# Altium schematic sheet 11-DSP PROCESSOR 1-OF-3.SchDoc
size 513 x 386 mm
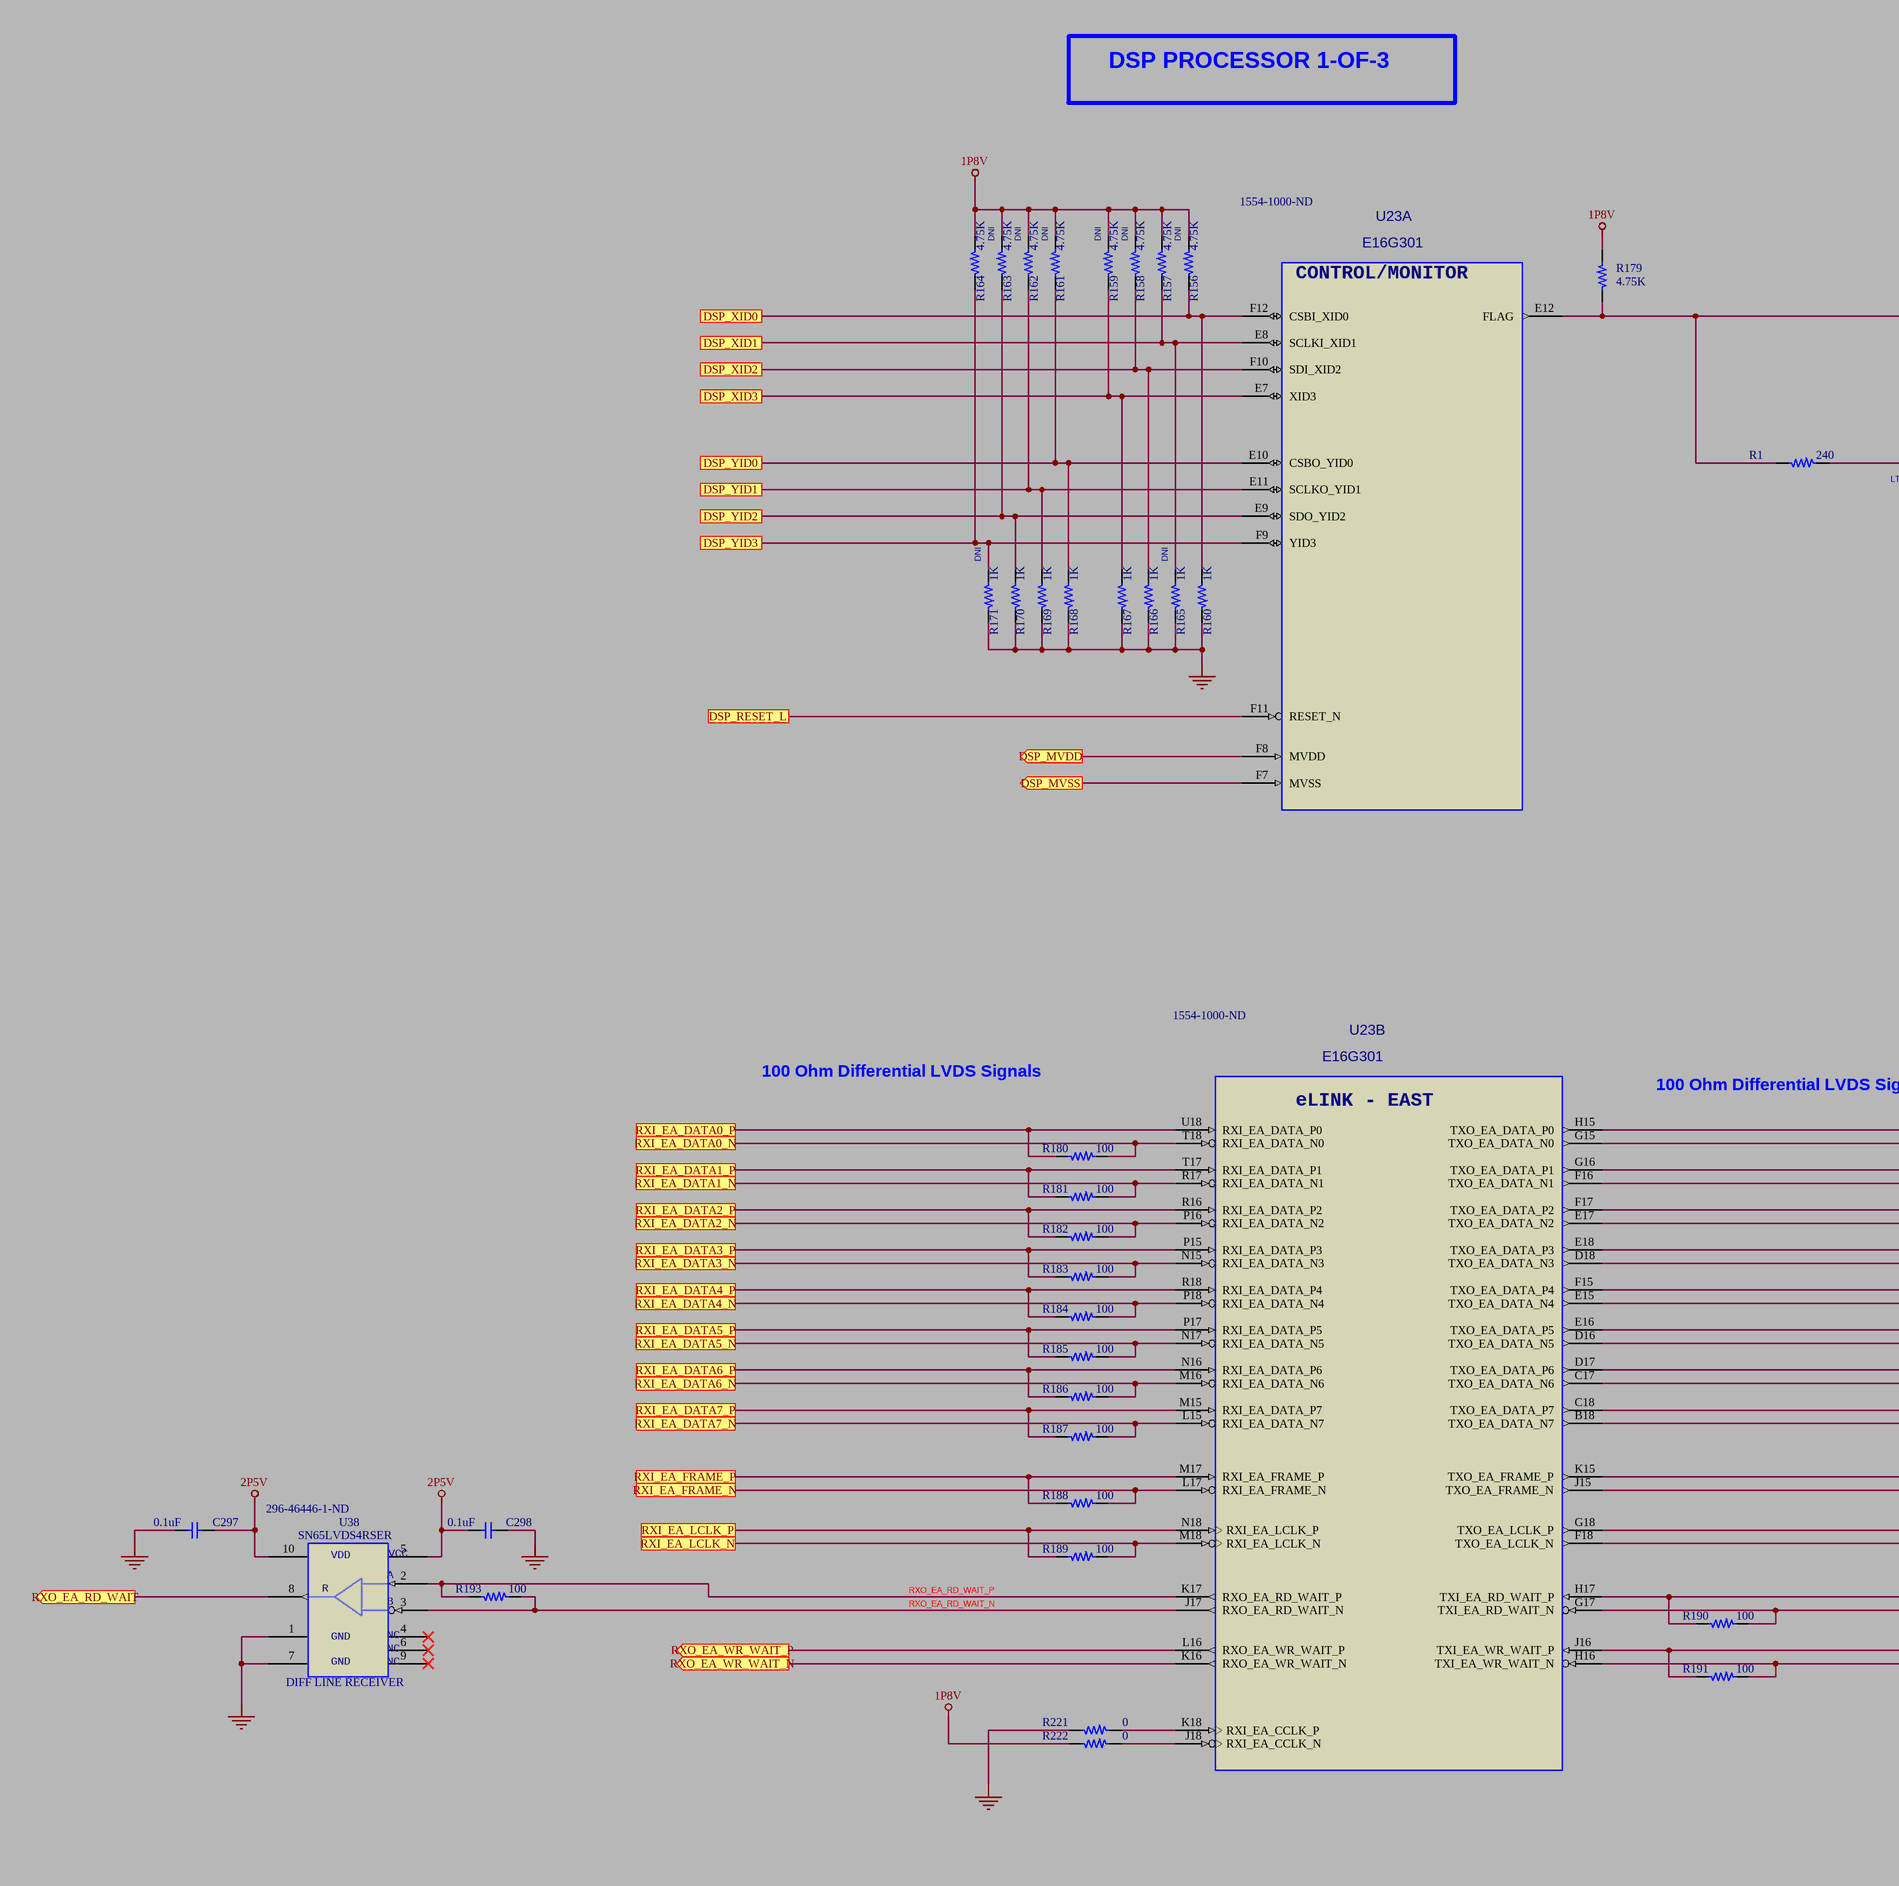
[diagram p0: 11-DSP PROCESSOR 1-OF-3.SchDoc, left]
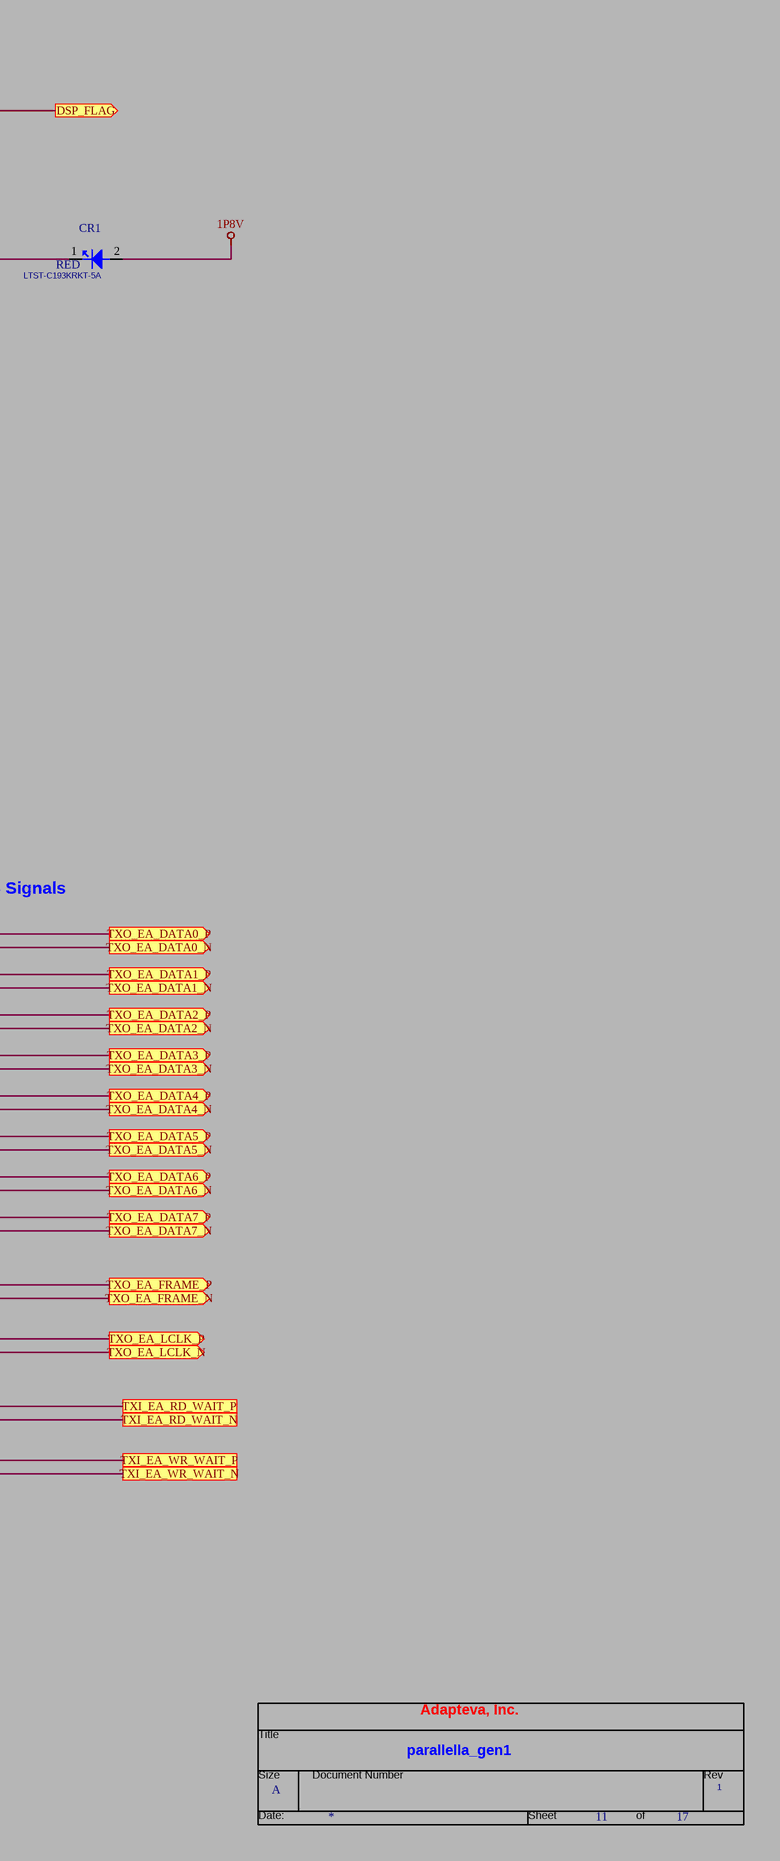
[diagram p1: 11-DSP PROCESSOR 1-OF-3.SchDoc, right]

## Parts
*  RevCode: 1  Title: parallella_gen1  Page Size: A  Page Number: 11  Page Count: 17  OrgAddr1: Adapteva, Inc.  (hidden comment: TitleBlock0)  (graphical)
C297  0.1uF  [C0402]
C298  0.1uF  [C0402]
CR1  RED  Vendor PN: LTST-C193KRKT-5A  [LED_0603]
R1  240  [R0402]
R156  4.75K  INSTALL: DNI  [R0402]
R157  4.75K  [R0402]
R158  4.75K  INSTALL: DNI  [R0402]
R159  4.75K  INSTALL: DNI  [R0402]
R160  1K  [R0402]
R161  4.75K  INSTALL: DNI  [R0402]
R162  4.75K  INSTALL: DNI  [R0402]
R163  4.75K  INSTALL: DNI  [R0402]
R164  4.75K  [R0402]
R165  1K  INSTALL: DNI  [R0402]
R166  1K  [R0402]
R167  1K  [R0402]
R168  1K  [R0402]
R169  1K  [R0402]
R170  1K  [R0402]
R171  1K  INSTALL: DNI  [R0402]
R179  4.75K  [R0402]
R180  100  [R0402]
R181  100  [R0402]
R182  100  [R0402]
R183  100  [R0402]
R184  100  [R0402]
R185  100  [R0402]
R186  100  [R0402]
R187  100  [R0402]
R188  100  [R0402]
R189  100  [R0402]
R190  100  [R0402]
R191  100  [R0402]
R193  100  [R0402]
R221  0  [R0402]
R222  0  [R0402]
U23  Vendor PN: E16G301  Supplier Part Number 1: 1554-1000-ND  [BGA324_15SQX1P5_P8MMP]  (hidden comment: 16-CORE MICROPROCESSOR)  (parts A,B of 6)
U38  DIFF LINE RECEIVER  Vendor PN: SN65LVDS4RSER  Supplier Part Number 1: 296-46446-1-ND  [QFN-10_1P55X2P05XP6XP5MMP]

## Ports
DSP_FLAG (out), DSP_MVDD (out), DSP_MVSS (out), DSP_RESET_L, DSP_XID0, DSP_XID1, DSP_XID2, DSP_XID3, DSP_YID0, DSP_YID1, DSP_YID2, DSP_YID3, RXI_EA_DATA0_N, RXI_EA_DATA0_P, RXI_EA_DATA1_N, RXI_EA_DATA1_P, RXI_EA_DATA2_N, RXI_EA_DATA2_P, RXI_EA_DATA3_N, RXI_EA_DATA3_P, RXI_EA_DATA4_N, RXI_EA_DATA4_P, RXI_EA_DATA5_N, RXI_EA_DATA5_P, RXI_EA_DATA6_N, RXI_EA_DATA6_P, RXI_EA_DATA7_N, RXI_EA_DATA7_P, RXI_EA_FRAME_N, RXI_EA_FRAME_P, RXI_EA_LCLK_N, RXI_EA_LCLK_P, RXO_EA_RD_WAIT (out), RXO_EA_WR_WAIT_N (out), RXO_EA_WR_WAIT_P (out), TXI_EA_RD_WAIT_N, TXI_EA_RD_WAIT_P, TXI_EA_WR_WAIT_N, TXI_EA_WR_WAIT_P, TXO_EA_DATA0_N (out), TXO_EA_DATA0_P (out), TXO_EA_DATA1_N (out), TXO_EA_DATA1_P (out), TXO_EA_DATA2_N (out), TXO_EA_DATA2_P (out), TXO_EA_DATA3_N (out), TXO_EA_DATA3_P (out), TXO_EA_DATA4_N (out), TXO_EA_DATA4_P (out), TXO_EA_DATA5_N (out), TXO_EA_DATA5_P (out), TXO_EA_DATA6_N (out), TXO_EA_DATA6_P (out), TXO_EA_DATA7_N (out), TXO_EA_DATA7_P (out), TXO_EA_FRAME_N (out), TXO_EA_FRAME_P (out), TXO_EA_LCLK_N (out), TXO_EA_LCLK_P (out)

## Nets
1P8V: CR1.2(A) R156.2 R157.2 R158.2 R159.2 R161.2 R162.2 R163.2 R164.2 R179.2 R222.1
2P5V: C297.2 C298.1 U38.5(VCC) U38.10(VDD)
GND: C297.1 C298.2 R160.2 R165.2 R166.2 R167.2 R168.2 R169.2 R170.2 R171.2 R221.1 U38.1(GND1) U38.7(GND2)
DSP_FLAG: R1.1 R179.1 U23.E12(FLAG) ; port DSP_FLAG
DSP_MVDD: U23.F8(MVDD) ; port DSP_MVDD
DSP_MVSS: U23.F7(MVSS) ; port DSP_MVSS
DSP_RESET_L: U23.F11(RESET_N) ; port DSP_RESET_L
DSP_XID0: R156.1 R160.1 U23.F12(CSBI_XID0) ; port DSP_XID0
DSP_XID1: R157.1 R165.1 U23.E8(SCLKI_XID1) ; port DSP_XID1
DSP_XID2: R158.1 R166.1 U23.F10(SDI_XID2) ; port DSP_XID2
DSP_XID3: R159.1 R167.1 U23.E7(XID3) ; port DSP_XID3
DSP_YID0: R161.1 R168.1 U23.E10(CSBO_YID0) ; port DSP_YID0
DSP_YID1: R162.1 R169.1 U23.E11(SCLKO_YID1) ; port DSP_YID1
DSP_YID2: R163.1 R170.1 U23.E9(SDO_YID2) ; port DSP_YID2
DSP_YID3: R164.1 R171.1 U23.F9(YID3) ; port DSP_YID3
RXI_EA_DATA0_N: R180.2 U23.T18(RXI_EA_DATA_N0) ; port RXI_EA_DATA0_N
RXI_EA_DATA0_P: R180.1 U23.U18(RXI_EA_DATA_P0) ; port RXI_EA_DATA0_P
RXI_EA_DATA1_N: R181.2 U23.R17(RXI_EA_DATA_N1) ; port RXI_EA_DATA1_N
RXI_EA_DATA1_P: R181.1 U23.T17(RXI_EA_DATA_P1) ; port RXI_EA_DATA1_P
RXI_EA_DATA2_N: R182.2 U23.P16(RXI_EA_DATA_N2) ; port RXI_EA_DATA2_N
RXI_EA_DATA2_P: R182.1 U23.R16(RXI_EA_DATA_P2) ; port RXI_EA_DATA2_P
RXI_EA_DATA3_N: R183.2 U23.N15(RXI_EA_DATA_N3) ; port RXI_EA_DATA3_N
RXI_EA_DATA3_P: R183.1 U23.P15(RXI_EA_DATA_P3) ; port RXI_EA_DATA3_P
RXI_EA_DATA4_N: R184.2 U23.P18(RXI_EA_DATA_N4) ; port RXI_EA_DATA4_N
RXI_EA_DATA4_P: R184.1 U23.R18(RXI_EA_DATA_P4) ; port RXI_EA_DATA4_P
RXI_EA_DATA5_N: R185.2 U23.N17(RXI_EA_DATA_N5) ; port RXI_EA_DATA5_N
RXI_EA_DATA5_P: R185.1 U23.P17(RXI_EA_DATA_P5) ; port RXI_EA_DATA5_P
RXI_EA_DATA6_N: R186.2 U23.M16(RXI_EA_DATA_N6) ; port RXI_EA_DATA6_N
RXI_EA_DATA6_P: R186.1 U23.N16(RXI_EA_DATA_P6) ; port RXI_EA_DATA6_P
RXI_EA_DATA7_N: R187.2 U23.L15(RXI_EA_DATA_N7) ; port RXI_EA_DATA7_N
RXI_EA_DATA7_P: R187.1 U23.M15(RXI_EA_DATA_P7) ; port RXI_EA_DATA7_P
RXI_EA_FRAME_N: R188.2 U23.L17(RXI_EA_FRAME_N) ; port RXI_EA_FRAME_N
RXI_EA_FRAME_P: R188.1 U23.M17(RXI_EA_FRAME_P) ; port RXI_EA_FRAME_P
RXI_EA_LCLK_N: R189.2 U23.M18(RXI_EA_LCLK_N) ; port RXI_EA_LCLK_N
RXI_EA_LCLK_P: R189.1 U23.N18(RXI_EA_LCLK_P) ; port RXI_EA_LCLK_P
RXO_EA_RD_WAIT: U38.8(R) ; port RXO_EA_RD_WAIT
RXO_EA_RD_WAIT_N: R193.2 U23.J17(RXO_EA_RD_WAIT_N) U38.3(B)
RXO_EA_RD_WAIT_P: R193.1 U23.K17(RXO_EA_RD_WAIT_P) U38.2(A)
RXO_EA_WR_WAIT_N: U23.K16(RXO_EA_WR_WAIT_N) ; port RXO_EA_WR_WAIT_N
RXO_EA_WR_WAIT_P: U23.L16(RXO_EA_WR_WAIT_P) ; port RXO_EA_WR_WAIT_P
TXI_EA_RD_WAIT_N: R190.2 U23.G17(TXI_EA_RD_WAIT_N) ; port TXI_EA_RD_WAIT_N
TXI_EA_RD_WAIT_P: R190.1 U23.H17(TXI_EA_RD_WAIT_P) ; port TXI_EA_RD_WAIT_P
TXI_EA_WR_WAIT_N: R191.2 U23.H16(TXI_EA_WR_WAIT_N) ; port TXI_EA_WR_WAIT_N
TXI_EA_WR_WAIT_P: R191.1 U23.J16(TXI_EA_WR_WAIT_P) ; port TXI_EA_WR_WAIT_P
TXO_EA_DATA0_N: U23.G15(TXO_EA_DATA_N0) ; port TXO_EA_DATA0_N
TXO_EA_DATA0_P: U23.H15(TXO_EA_DATA_P0) ; port TXO_EA_DATA0_P
TXO_EA_DATA1_N: U23.F16(TXO_EA_DATA_N1) ; port TXO_EA_DATA1_N
TXO_EA_DATA1_P: U23.G16(TXO_EA_DATA_P1) ; port TXO_EA_DATA1_P
TXO_EA_DATA2_N: U23.E17(TXO_EA_DATA_N2) ; port TXO_EA_DATA2_N
TXO_EA_DATA2_P: U23.F17(TXO_EA_DATA_P2) ; port TXO_EA_DATA2_P
TXO_EA_DATA3_N: U23.D18(TXO_EA_DATA_N3) ; port TXO_EA_DATA3_N
TXO_EA_DATA3_P: U23.E18(TXO_EA_DATA_P3) ; port TXO_EA_DATA3_P
TXO_EA_DATA4_N: U23.E15(TXO_EA_DATA_N4) ; port TXO_EA_DATA4_N
TXO_EA_DATA4_P: U23.F15(TXO_EA_DATA_P4) ; port TXO_EA_DATA4_P
TXO_EA_DATA5_N: U23.D16(TXO_EA_DATA_N5) ; port TXO_EA_DATA5_N
TXO_EA_DATA5_P: U23.E16(TXO_EA_DATA_P5) ; port TXO_EA_DATA5_P
TXO_EA_DATA6_N: U23.C17(TXO_EA_DATA_N6) ; port TXO_EA_DATA6_N
TXO_EA_DATA6_P: U23.D17(TXO_EA_DATA_P6) ; port TXO_EA_DATA6_P
TXO_EA_DATA7_N: U23.B18(TXO_EA_DATA_N7) ; port TXO_EA_DATA7_N
TXO_EA_DATA7_P: U23.C18(TXO_EA_DATA_P7) ; port TXO_EA_DATA7_P
TXO_EA_FRAME_N: U23.J15(TXO_EA_FRAME_N) ; port TXO_EA_FRAME_N
TXO_EA_FRAME_P: U23.K15(TXO_EA_FRAME_P) ; port TXO_EA_FRAME_P
TXO_EA_LCLK_N: U23.F18(TXO_EA_LCLK_N) ; port TXO_EA_LCLK_N
TXO_EA_LCLK_P: U23.G18(TXO_EA_LCLK_P) ; port TXO_EA_LCLK_P
NetCR1_1: CR1.1(C) R1.2
NetR221_2: R221.2 U23.K18(RXI_EA_CCLK_P)
NetR222_2: R222.2 U23.J18(RXI_EA_CCLK_N)

Not connected (* = marked no-connect by the designer): U38 4(NC1)* 6(NC2)* 9(NC3)*

## Notes on the sheet
- DSP PROCESSOR 1-OF-3
- 100 Ohm Differential LVDS Signals
- (in symbol EPIPHANY_E16G301, part A) CONTROL/MONITOR
- (in symbol EPIPHANY_E16G301, part B) eLINK - EAST
- (in symbol SN65LVDS4) GND; NC
- (in symbol TitleBlock0) Title; Size; Document Number; Rev; Date:; Sheet; of

## Library data of the parts
C297 C298 = CAP0402_0P1UF_X5R_35V: CAP, 0402, 0.1UF, X5R, 35V; ALT_SYMBOLS: C0402_BGA; Vendor PN: GMK105BJ104KV-F; Vendor: TAIYO YUDEN; DEVICE: CAP0402_0P1UF_X5R_35V; MFG PART NO: GMK105BJ104KV-F; MFG: TAIYO YUDEN; PCB Footprint: C0402
CR1 = LED_0603_5MA_RED: LED, 0603, 5MA, SMT, RED; Voltage: 2V; MFG: LITE-ON INC; MFG PART NO: LTST-C193KRKT-5A; Vendor: LITE-ON INC; PCB Footprint: LED_0603
R1 = RES0402_240: RES, 0402, 240, 1%; MFG PART NO: CRCW0402240RFKED; ALT_SYMBOLS: R0402_BGA; MFG: VISHAY; Vendor: VISHAY/DALE; DEVICE: RES0402_240; Vendor PN: CRCW0402240RFKED; PCB Footprint: R0402
R156-R159 R161-R164 R179 = RES0402_4K75: RES, 0402, 4.75K, 1%; MFG PART NO: CRCW04024K75FKED; MFG: VISHAY; Vendor: VISHAY/DALE; ALT_SYMBOLS: R0402_BGA; DEVICE: RES0402_4K75; Vendor PN: CRCW04024K75FKED; PCB Footprint: R0402
R160 R165-R171 = RES0402_1K: RES, 0402, 1K; MFG PART NO: CRCW04021K00FKED; ALT_SYMBOLS: R0402_BGA; MFG: VISHAY; Vendor: VISHAY/DALE; DEVICE: RES0402_1K; Vendor PN: CRCW04021K00FKED; PCB Footprint: R0402
R180-R191 R193 = RES0402_100: RES, 0402, 100, 1%; ALT_SYMBOLS: R0402_BGA; Vendor PN: CRCW0402100RFKED; Vendor: VISHAY/DALE; MFG: VISHAY; MFG PART NO: CRCW0402100RFKED; DEVICE: RES0402_100; PCB Footprint: R0402
R221 R222 = RES0402_0: RES, 0402, 0 OHM, 1%; MFG PART NO: CRCW04020000Z0ED; ALT_SYMBOLS: R0402_BGA; MFG: VISHAY; Vendor: VISHAY/DALE; DEVICE: RES0402_0; Vendor PN: CRCW04020000Z0ED; PCB Footprint: R0402
U23 = EPIPHANY_E16G301: IC, 16-CORE MICROPROCESSOR, ADAPTEVA, E16G301, BGA324; SPLIT_INST: TRUE; Vendor: ADAPTEVA; DEVICE: EPIPHANY_E16G301; PCB Footprint: BGA324_15SQX1P5_P8MMP; Supplier 1: Digi-Key
U38 = SN65LVDS4: IC, LINE RECEIVER, DIFFERENTIAL LVDS, UFQFN10; Vendor: TEXAS INSTRUMENTS; DEVICE: SN65LVDS4; MFG: TEXAS INSTRUMENTS; MFG PART NO: SN65LVDS4RSER; PCB Footprint: QFN-10_1P55X2P05XP6XP5MMP; Supplier 1: Digi-Key
* = TitleBlock0: Page Create Date: March  8, 1995; Page Modify Date: *